# Altium schematic sheet schem1.SchDoc: Power Regulation
size A; Author: Bryton King; DrawnBy: Bryton King; Revision: 1; SheetNumber: 1; SheetTotal: 3
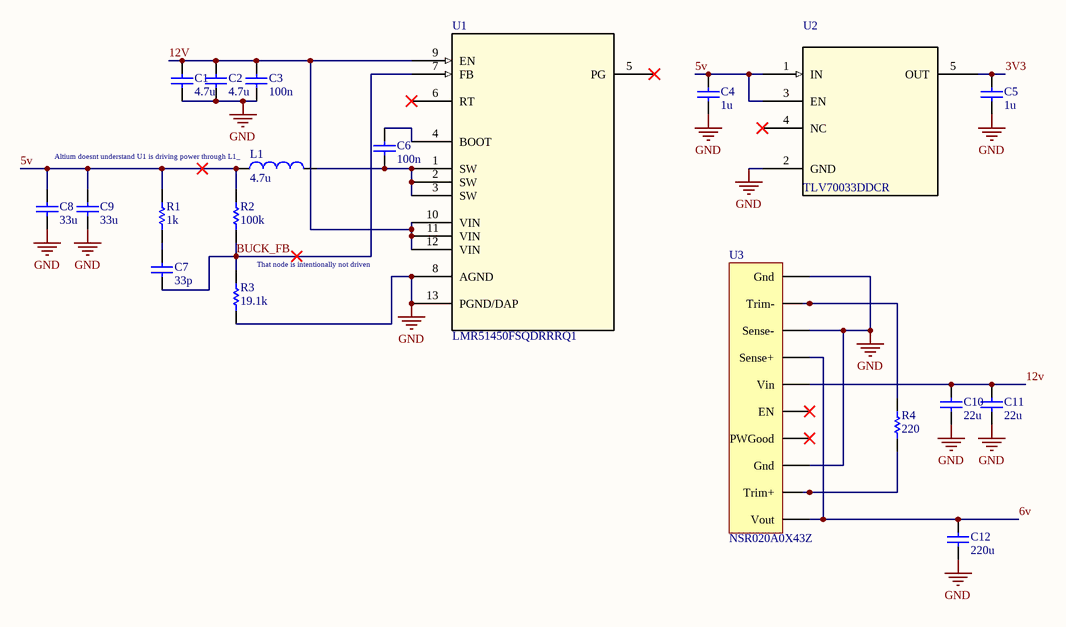
[diagram p0: schem1.SchDoc]

## Parts
C1  value 4.7u  [4.7u]  (hidden comment: Capacitor)
C2  value 4.7u  [4.7u]  (hidden comment: Capacitor)
C3  value 100n  [.1U]  (hidden comment: Capacitor)
C4  value 1u  [1U]  (hidden comment: Capacitor)
C5  value 1u  [1U]  (hidden comment: Capacitor)
C6  value 100n  [.1U]  (hidden comment: Capacitor)
C7  value 33p  [Cap33u]  (hidden comment: Capacitor)
C8  value 33u  [Cap33u]  (hidden comment: Capacitor)
C9  value 33u  [Cap33u]  (hidden comment: Capacitor)
C10  value 22u  [22u]  (hidden comment: Capacitor)
C11  value 22u  [22u]  (hidden comment: Capacitor)
C12  value 220u  [4.7u]  (hidden comment: Capacitor)
L1  value 4.7u  [4.7uIND]  (hidden comment: Inductor)
R1  value 1k  [resistor]  (hidden comment: Resistor)
R2  value 100k  [resistor]  (hidden comment: Resistor)
R3  value 19.1k  [resistor]  (hidden comment: Resistor)
R4  value 220  [resistor]  (hidden comment: Resistor)
U1  LMR51450FSQDRRRQ1  [LMR51450FSQDRRRQ1]
U2  TLV70033DDCR  [TLV70033DDCR]
U3  NSR020A0X43Z  [NSR020A0X43Z]

## Nets
GND: C1.1 C2.1 C3.1 C4.1 C5.1 C8.2 C9.2 C10.1 C11.1 C12.1 R3.1 U1.8(AGND) U1.13(PGND/DAP) U2.2(GND) U3.3(Gnd) U3.8(Sense-) U3.10(Gnd)
3V3: C5.2 U2.5(OUT)
5v: C4.2 C8.1 C9.1 L1.1 R1.2 R2.2 U2.1(IN) U2.3(EN)
6v: C12.2 U3.1(Vout) U3.7(Sense+)
12v: C1.2 C2.2 C3.2 C10.2 C11.2 U1.9(EN) U1.10(VIN) U1.11(VIN) U1.12(VIN) U3.6(Vin)
BUCK_FB: C7.2 R2.1 R3.2 U1.7(FB)
NetC6_1: C6.1 L1.2 U1.1(SW) U1.2(SW) U1.3(SW)
NetC6_2: C6.2 U1.4(BOOT)
NetC7_1: C7.1 R1.1
NetR4_1: R4.1 U3.2(Trim+)
NetR4_2: R4.2 U3.9(Trim-)

Not connected (* = marked no-connect by the designer): U1 5(PG)* 6(RT)*; U2 4(NC)*; U3 4(PWGood)* 5(EN)*

## Notes on the sheet
- (near L1) Altium doesnt understand U1 is driving power through L1_
- That node is intentionally not driven

## Library data of the parts
C1-C12 = Capacitor: SimulationGenericComponent: True
L1 = Inductor: SimulationGenericComponent: True
R1-R4 = Resistor: TC1: 0; SimulationGenericComponent: True; TC2: 0